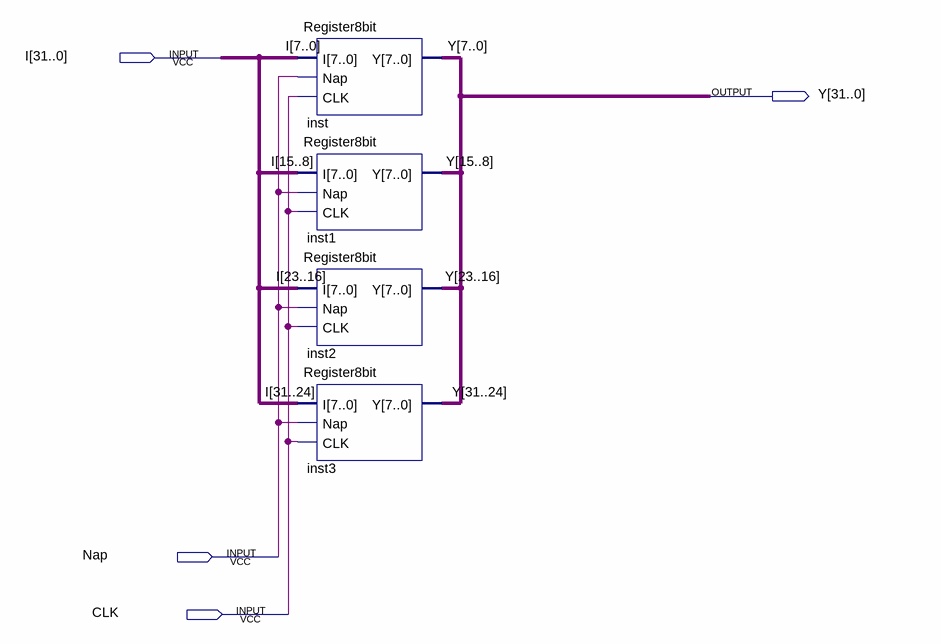
[diagram p0: schematic sheet]
// Quartus schematic Register32bit_Nap.bdf as structural Verilog: 4 symbols, 4 pins
module Register32bit_Nap (
  input  [31:0] I,
  input  Nap,
  input  CLK,
  output [31:0] Y
);

  Register8bit inst (.I(I[7:0]), .Nap(Nap), .CLK(CLK), .Y(Y[7:0]));
  Register8bit inst1 (.I(I[15:8]), .Nap(Nap), .CLK(CLK), .Y(Y[15:8]));
  Register8bit inst2 (.I(I[23:16]), .Nap(Nap), .CLK(CLK), .Y(Y[23:16]));
  Register8bit inst3 (.I(I[31:24]), .Nap(Nap), .CLK(CLK), .Y(Y[31:24]));
endmodule
